# Altium schematic sheet FPGA_Bank2-3.SchDoc: =DocumentName
size A3; DocumentNumber: 1; Revision: 0; SheetNumber: 16; SheetTotal: 18
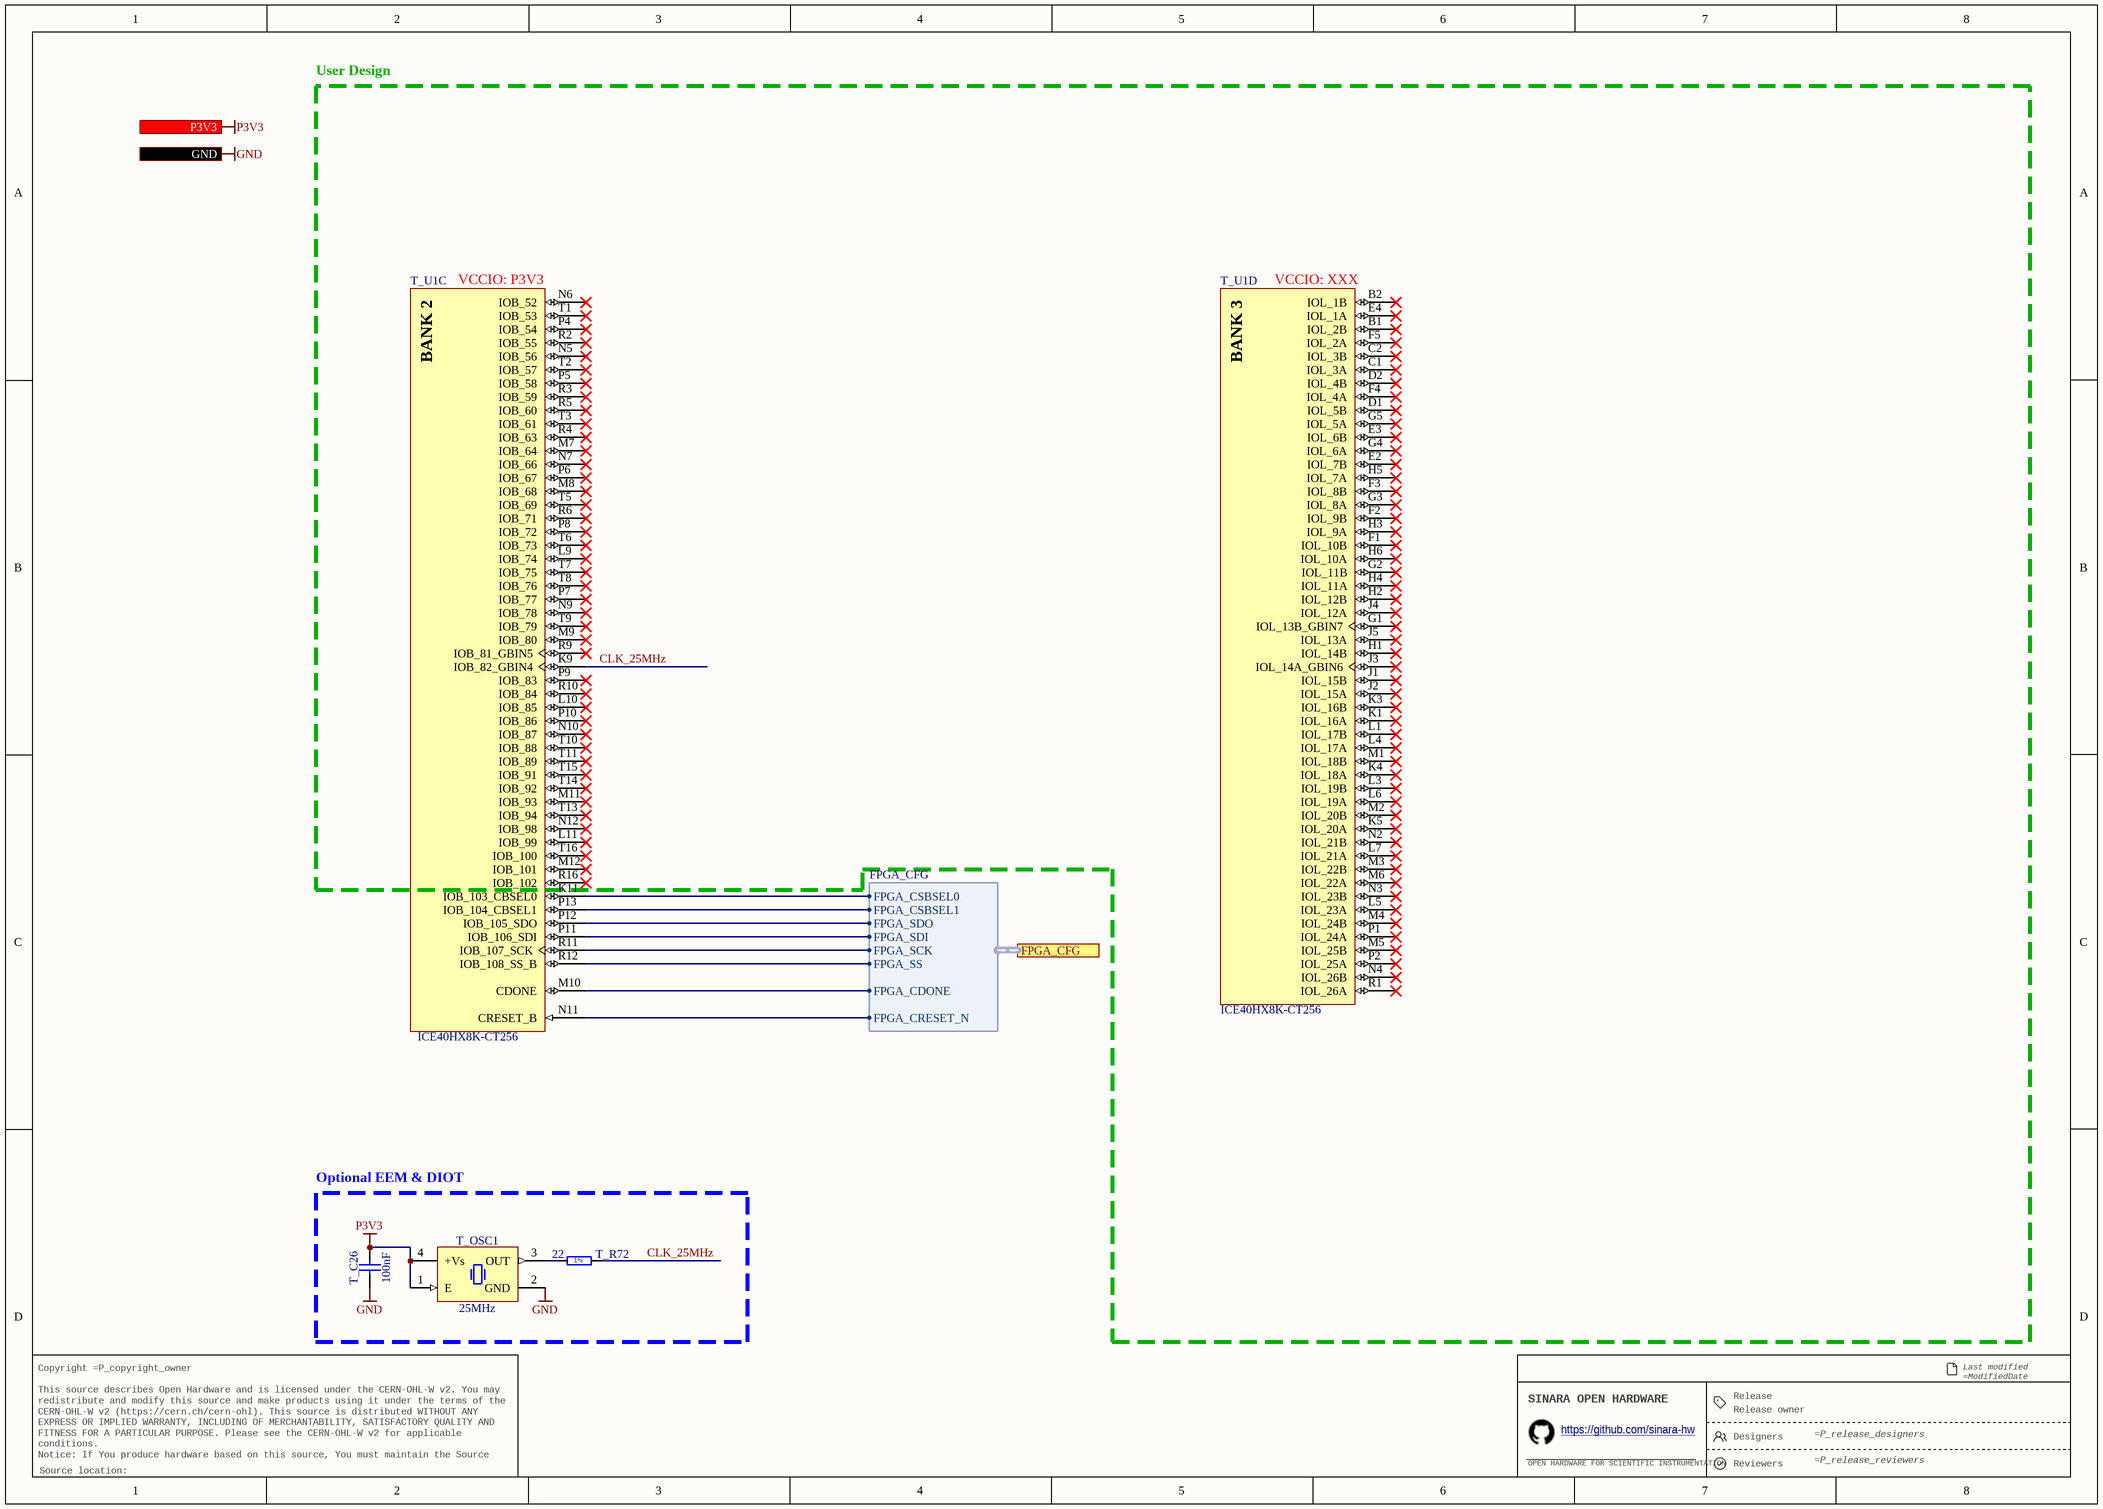
[diagram p0: FPGA_Bank2-3.SchDoc]

## Parts
T_C26  100nF  [CAPC1005X55N]
T_OSC1  25MHz  [OSC_IQD_CFPS-39]
T_R72  22  [RESC1005X40N]
T_U1  ICE40HX8K-CT256  [LATC-caBGA-256]  (parts C,D of 5)

## Blocks framed on the sheet
Optional EEM & DIOT: T_C26 T_OSC1 T_R72

## Ports
FPGA_CFG (harness FPGA_CFG), GND, P3V3 (in)

## Harnesses
FPGA_CFG: FPGA_CSBSEL0, FPGA_CSBSEL1, FPGA_SDO, FPGA_SDI, FPGA_SCK, FPGA_SS, FPGA_CDONE, FPGA_CRESET_N

## Nets
GND: T_C26.1 T_OSC1.2(GND) ; port GND
P3V3: T_C26.2 T_OSC1.1(E) T_OSC1.4(+Vs) ; port P3V3
CLK_25MHz: T_R72.2 T_U1.K9(IOB_82_GBIN4)
NetT_OSC1_3: T_OSC1.3(OUT) T_R72.1
NetT_U1_K11: T_U1.K11(IOB_103_CBSEL0) ; port FPGA_CFG.FPGA_CSBSEL0
NetT_U1_M10: T_U1.M10(CDONE) ; port FPGA_CFG.FPGA_CDONE
NetT_U1_N11: T_U1.N11(CRESET_B) ; port FPGA_CFG.FPGA_CRESET_N
NetT_U1_P11: T_U1.P11(IOB_106_SDI) ; port FPGA_CFG.FPGA_SDI
NetT_U1_P12: T_U1.P12(IOB_105_SDO) ; port FPGA_CFG.FPGA_SDO
NetT_U1_P13: T_U1.P13(IOB_104_CBSEL1) ; port FPGA_CFG.FPGA_CSBSEL1
NetT_U1_R11: T_U1.R11(IOB_107_SCK) ; port FPGA_CFG.FPGA_SCK
NetT_U1_R12: T_U1.R12(IOB_108_SS_B) ; port FPGA_CFG.FPGA_SS

Not connected (* = marked no-connect by the designer): T_U1 B1(IOL_2B)* B2(IOL_1B)* C1(IOL_3A)* C2(IOL_3B)* D1(IOL_5B)* D2(IOL_4B)* E2(IOL_7B)* E3(IOL_6B)* E4(IOL_1A)* F1(IOL_10B)* F2(IOL_9B)* F3(IOL_8B)* F4(IOL_4A)* F5(IOL_2A)* G1(IOL_13B_GBIN7)* G2(IOL_11B)* G3(IOL_8A)* G4(IOL_6A)* G5(IOL_5A)* H1(IOL_14B)* H2(IOL_12B)* H3(IOL_9A)* H4(IOL_11A)* H5(IOL_7A)* H6(IOL_10A)* J1(IOL_15B)* J2(IOL_15A)* J3(IOL_14A_GBIN6)* J4(IOL_12A)* J5(IOL_13A)* K1(IOL_16A)* K3(IOL_16B)* K4(IOL_18A)* K5(IOL_20A)* L1(IOL_17B)* L3(IOL_19B)* L4(IOL_17A)* L5(IOL_23A)* L6(IOL_19A)* L7(IOL_21A)* L9(IOB_74)* L10(IOB_85)* L11(IOB_99)* M1(IOL_18B)* M2(IOL_20B)* M3(IOL_22B)* M4(IOL_24B)* M5(IOL_25B)* M6(IOL_22A)* M7(IOB_64)* M8(IOB_68)* M9(IOB_80)* M11(IOB_93)* M12(IOB_101)* N2(IOL_21B)* N3(IOL_23B)* N4(IOL_26B)* N5(IOB_56)* N6(IOB_52)* N7(IOB_66)* N9(IOB_78)* N10(IOB_87)* N12(IOB_98)* P1(IOL_24A)* P2(IOL_25A)* P4(IOB_54)* P5(IOB_58)* P6(IOB_67)* P7(IOB_77)* P8(IOB_72)* P9(IOB_83)* P10(IOB_86)* R1(IOL_26A)* R2(IOB_55)* R3(IOB_59)* R4(IOB_63)* R5(IOB_60)* R6(IOB_71)* R9(IOB_81_GBIN5)* R10(IOB_84)* R16(IOB_102)* T1(IOB_53)* T2(IOB_57)* T3(IOB_61)* T5(IOB_69)* T6(IOB_73)* T7(IOB_75)* T8(IOB_76)* T9(IOB_79)* T10(IOB_88)* T11(IOB_89)* T13(IOB_94)* T14(IOB_92)* T15(IOB_91)* T16(IOB_100)*

## Notes on the sheet
- User Design
- (near T_U1) VCCIO: P3V3
- (near T_U1) VCCIO: XXX
- Release
- Last modified =ModifiedDate
  Sheet =sheetnumber of =sheettotal · Size A3
- Copyright =P_copyright_owner
  This source describes Open Hardware and is licensed under the CERN-OHL-W v2. You may redistribute and modify this source and make products using it under the terms of the CERN-OHL-W v2 (https://cern.ch/cern-ohl). This source is distributed WITHOUT ANY EXPRESS OR IMPLIED WARRANTY, INCLUDING OF MERCHANTABILITY, SATISFACTORY QUALITY AND FITNESS FOR A PARTICULAR PURPOSE. Please see the CERN-OHL-W v2 for applicable conditions.
  Notice: If You produce hardware based on this source, You must maintain the Source Location visible on the product, its packaging or its documentation.
- SINARA OPEN HARDWARE
- OPEN HARDWARE FOR SCIENTIFIC INSTRUMENTATION
- https://github.com/sinara-hw
- Release owner
- Designers
- Reviewers
- Source location:
- (in symbol CMP-0962-00001-1, part C) BANK 2
- (in symbol CMP-0962-00001-1, part D) BANK 3
- (in symbol R0402_22R_1%_0.0625W_100PPM) 1%

## Library data of the parts
T_C26 = CC0402_100NF_50V_10%_X7R: Non-polarised capacitor; Part Description: SMD Multilayer Chip Ceramic Capacitor; Manufacturer: GENERIC; Manufacturer1 Part Number: GRM155R71H104KE14D; Voltage: 50V; TC: X7R; Tolerance: ±10%; Part Number: CC0402_100NF_50V_10%_X7R; Component Kind: Standard; Component Type: Standard; Pin Count: 2; Value: 100nF; Status: None; Manufacturer Part Number: CC0402_100NF_50V_10%_X7R; Case: 0402; Mounted: Yes; Socket: No; SMD: Yes; Sense: No; Manufacturer1 Example: MURATA; Manufacturer1 ComponentHeight: 0.55mm; HelpURL: \\cern.ch\dfs\Applications\Altium\Datasheets\CC0402_MURATA_GRM155R71H104KE14D.pdf; Author: CERN DEM MR; CreateDate: 30.06.2017; LatestRevisionDate: 30.06.2017
T_OSC1 = OSC_25MHZ_IQD_LFSPXO025165: Oscillator 4 pins 1=E 2=GND 3=OUT 4=+Vs; Part Description: 3.3V, ±50ppm, 15pF, -40 to 85°C, CMOS Surface Mount Clock Oscillator (CFPS-39 Series); Manufacturer: IQD FREQUENCY PRODUCTS; PressFit: No; Bonding: No; Part Number: OSC_25MHZ_IQD_LFSPXO025165; Component Kind: Standard; Component Type: Standard; PackageDescription: Oscillator, Corner Concave, 2.20mm Pitch, 4 Pins, 2.70mm L X 3.40mm W X 1.20mm H, CFPS-39 Series; Value: 25MHz; Manufacturer Part Number: LFSPXO025165; Pin Count: 4; Mounted: Yes; Socket: No; SMD: Yes; Sense: No; ComponentHeight: 1.2mm; HelpURL: \\cern.ch\dfs\Applications\Altium\Datasheets\OSC_IQD_LFSPXO025165.pdf; Author: CERN DEM JLC; CreateDate: 02.12.2010; LatestRevisionDate: 03.11.2016
T_R72 = R0402_22R_1%_0.0625W_100PPM: Resistor - 1%; Part Description: General Purpose Thick Film Chip Resistor; Manufacturer: GENERIC; Manufacturer1 Part Number: 232270672209L; TC: ±100ppm/°C; PressFit: No; Part Number: R0402_22R_1%_0.0625W_100PPM; Component Kind: Standard; Component Type: Standard; Pin Count: 2; Value: 22; Status: Not Recommended; Power: 0.0625W; Tolerance: ±1%; Manufacturer Part Number: R0402_22R_1%_0.0625W_100PPM; Case: 0402; Mounted: Yes; Sense: No; Socket: No; SMD: Yes; Manufacturer1 Example: YAGEO PHYCOMP; Manufacturer1 ComponentHeight: 0.4mm; HelpURL: \\cern.ch\dfs\Applications\Altium\Datasheets\R0402_Phycomp_RC0402.pdf; Author: CERN DEM JLC; CreateDate: 03/12/2007; LatestRevisionDate: 17/10/2012
T_U1 = CMP-0962-00001-1: iCE40 HX8K Series FPGA Family, 7680 Logic Cells, 1.2 V Core, 128 K Embedded RAM Bits, 256-ball caBGA, Pb-Free, Tray; Manufacturer: Lattice Semiconductor; Supply Voltage: 1.2V; Phase-Locked Loops: 2; Logic Cells: 7680; Embedded RAM Bits: 128K; PackageReference: caBGA-256; PackageDescription: 256-Ball Chip Array Ball Grid Array, Body 14 x 14 mm, Pitch 0.8 mm; RoHS: TRUE; Packing: Tray; Mounting Technology: Surface Mount; ComponentLink3URL: http://www.latticesemi.com/lit/docs/package/pkg.pdf; ComponentLink1Description: Manufacturer URL; ComponentLink3Description: Package Specification; Code_JEDEC: MO-275; PackageVersion: Rev. 03.9, 02/2013; ComponentLink1URL: http://www.latticesemi.com/en; ComponentLink2URL: http://www.latticesemi.com/~/media/Documents/DataSheets/iCE/iCE40LPHXFamilyDataSheet.pdf; Manufacturer Part Number: ICE40HX8K-CT256; ComponentLink2Description: Datasheet; DatasheetVersion: Rev. 02.9